# Altium project CC2745R10_ChannelSounding_HW.PrjPcb
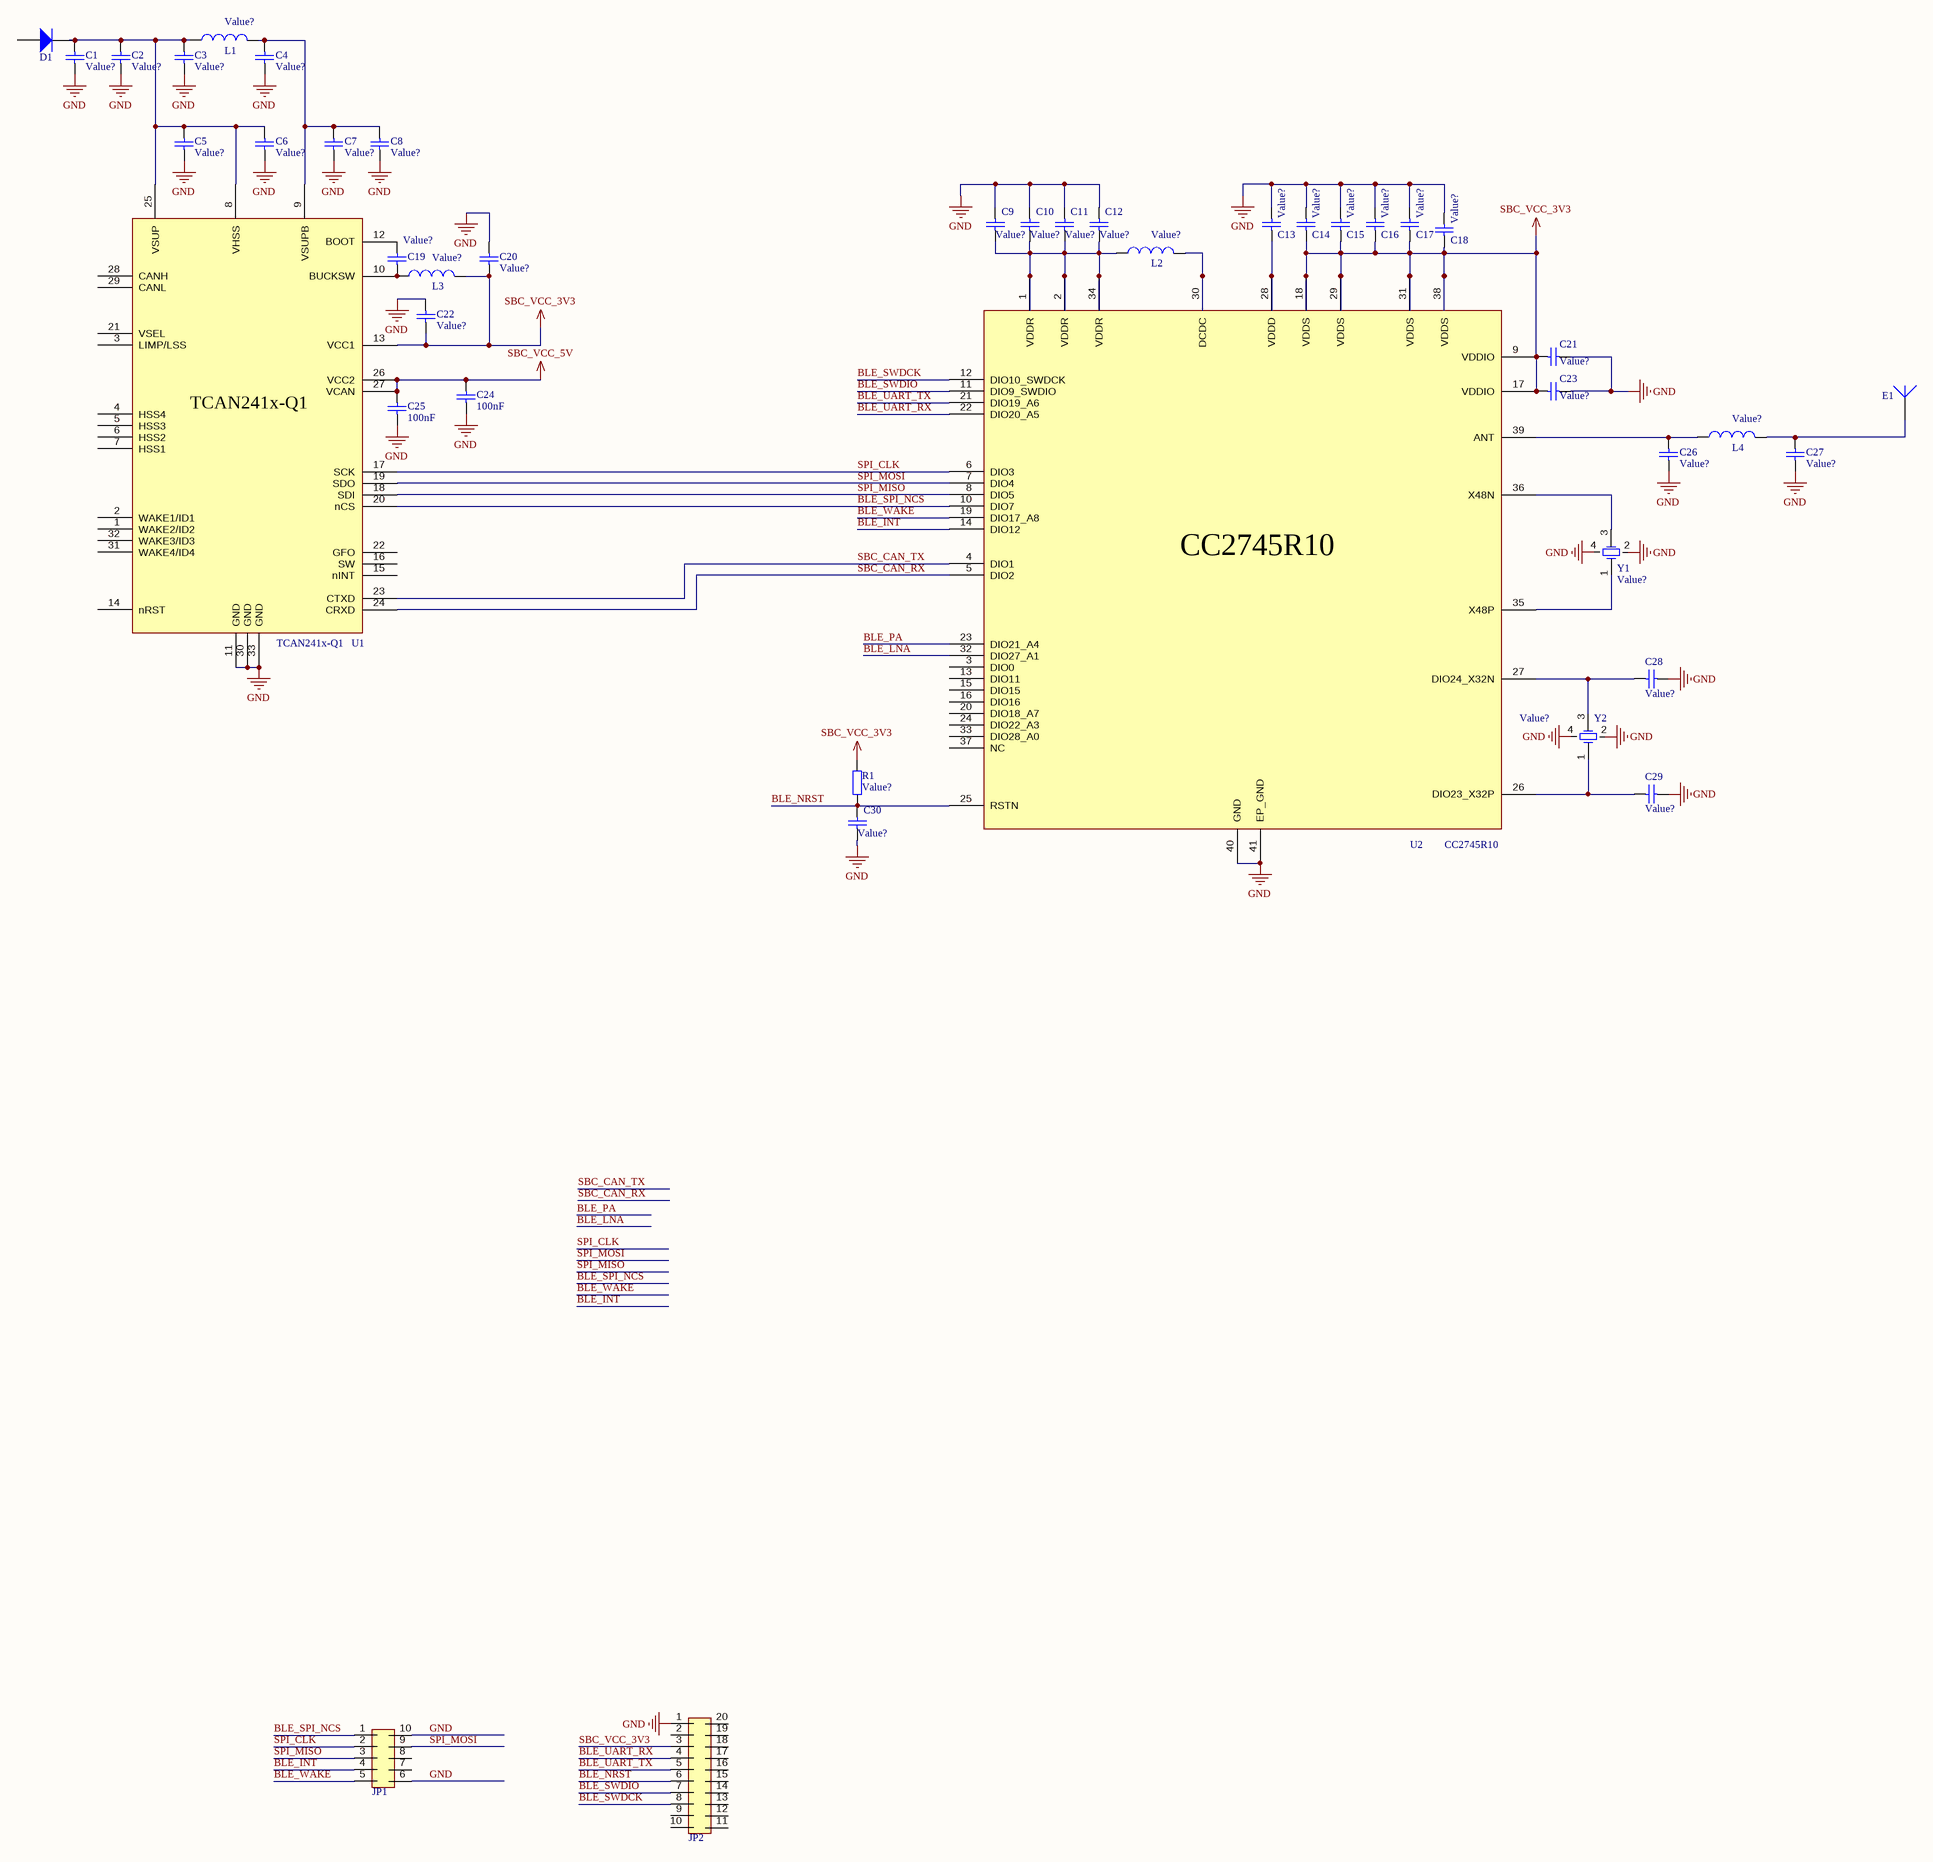
[diagram p0: Schematic.SchDoc]
1 sheet, 43 parts. Net scope: global (net labels, ports and power ports of the same name join across sheets).
Board file: Layout.PcbDoc

## Sheet Schematic.SchDoc
size 594 x 420 mm; SheetNumber: 1; SheetTotal: 1

### Parts
C1  value Value?  (hidden comment: Cap)
C2  value Value?  (hidden comment: Cap)
C3  value Value?  (hidden comment: Cap)
C4  value Value?  (hidden comment: Cap)
C5  value Value?  (hidden comment: Cap)
C6  value Value?  (hidden comment: Cap)
C7  value Value?  (hidden comment: Cap)
C8  value Value?  (hidden comment: Cap)
C9  value Value?  (hidden comment: Cap)
C10  value Value?  (hidden comment: Cap)
C11  value Value?  (hidden comment: Cap)
C12  value Value?  (hidden comment: Cap)
C13  value Value?  (hidden comment: Cap)
C14  value Value?  (hidden comment: Cap)
C15  value Value?  (hidden comment: Cap)
C16  value Value?  (hidden comment: Cap)
C17  value Value?  (hidden comment: Cap)
C18  value Value?  (hidden comment: Cap)
C19  value Value?  (hidden comment: Cap)
C20  value Value?  (hidden comment: Cap)
C21  value Value?  (hidden comment: Cap)
C22  value Value?  (hidden comment: Cap)
C23  value Value?  (hidden comment: Cap)
C24  value 100nF  (hidden comment: Cap)
C25  value 100nF  (hidden comment: Cap)
C26  value Value?  (hidden comment: Cap)
C27  value Value?  (hidden comment: Cap)
C28  value Value?  (hidden comment: Cap)
C29  value Value?  (hidden comment: Cap)
C30  value Value?  (hidden comment: Cap)
D1  Diode  (value not drawn)
E1  Antenna  (value not drawn)
JP1  Conn_02x05_Counter_Clockwise  (value not drawn)
JP2  Conn_02x10_Counter_Clockwise  (value not drawn)
L1  value Value?  (hidden comment: Inductor)
L2  value Value?  (hidden comment: Inductor)
L3  value Value?  (hidden comment: Inductor)
L4  value Value?  (hidden comment: Inductor)
R1  value Value?  (hidden comment: Res)
U1  TCAN241x-Q1
U2  CC2745R10
Y1  value Value?  (hidden comment: Crystal)
Y2  value Value?  (hidden comment: Crystal)

### Nets
GND: C1.1 C2.1 C3.1 C4.1 C5.1 C6.1 C7.1 C8.1 C9.2 C10.2 C11.2 C12.2 C13.2 C14.2 C15.2 C16.2 C17.2 C18.2 C20.1 C21.2 C22.2 C23.2 C24.1 C25.1 C26.1 C27.1 C28.2 C29.2 C30.1 JP1.6 JP1.10 JP2.1 U1.11(GND) U1.30(GND) U1.33(GND) U2.40(GND) U2.41(EP_GND) Y1.2(GND) Y1.4(GND) Y2.2(GND) Y2.4(GND)
SBC_VCC_3V3: C14.1 C15.1 C16.1 C17.1 C18.1 C20.2 C21.1 C22.1 C23.1 JP2.3 L3.2 R1.2 U1.13(VCC1) U2.9(VDDIO) U2.17(VDDIO) U2.18(VDDS) U2.29(VDDS) U2.31(VDDS) U2.38(VDDS)
SBC_VCC_5V: C24.2 C25.2 U1.26(VCC2) U1.27(VCAN)
BLE_INT: JP1.4 U2.14(DIO12)
BLE_LNA: U2.32(DIO27_A1)
BLE_NRST: C30.2 JP2.6 R1.1 U2.25(RSTN)
BLE_PA: U2.23(DIO21_A4)
BLE_SPI_NCS: JP1.1 U1.20(nCS) U2.10(DIO7)
BLE_SWDCK: JP2.8 U2.12(DIO10_SWDCK)
BLE_SWDIO: JP2.7 U2.11(DIO9_SWDIO)
BLE_UART_RX: JP2.4 U2.22(DIO20_A5)
BLE_UART_TX: JP2.5 U2.21(DIO19_A6)
BLE_WAKE: JP1.5 U2.19(DIO17_A8)
SBC_CAN_RX: U1.24(CRXD) U2.5(DIO2)
SBC_CAN_TX: U1.23(CTXD) U2.4(DIO1)
SPI_CLK: JP1.2 U1.17(SCK) U2.6(DIO3)
SPI_MISO: JP1.3 U1.18(SDI) U2.8(DIO5)
SPI_MOSI: JP1.9 U1.19(SDO) U2.7(DIO4)
NetC1_2: C1.2 C2.2 C3.2 C5.2 C6.2 D1.2(K) L1.1 U1.8(VHSS) U1.25(VSUP)
NetC4_2: C4.2 C7.2 C8.2 L1.2 U1.9(VSUPB)
NetC9_1: C9.1 C10.1 C11.1 C12.1 L2.1 U2.1(VDDR) U2.2(VDDR) U2.34(VDDR)
NetC13_1: C13.1 U2.28(VDDD)
NetC19_1: C19.1 L3.1 U1.10(BUCKSW)
NetC19_2: C19.2 U1.12(BOOT)
NetC26_2: C26.2 L4.1 U2.39(ANT)
NetC27_2: C27.2 E1.1(A) L4.2
NetC28_1: C28.1 U2.27(DIO24_X32N) Y2.3(OSC2)
NetC29_1: C29.1 U2.26(DIO23_X32P) Y2.1(OSC1)
NetL2_2: L2.2 U2.30(DCDC)
NetU2_35: U2.35(X48P) Y1.1(OSC1)
NetU2_36: U2.36(X48N) Y1.3(OSC2)

Not connected (* = marked no-connect by the designer): D1 1(A); JP1 7 8; JP2 2 9 10 11 12 13 14 15 16 17 18 19 20; U1 1(WAKE2/ID2) 2(WAKE1/ID1) 3(LIMP/LSS) 4(HSS4) 5(HSS3) 6(HSS2) 7(HSS1) 14(nRST) 15(nINT) 16(SW) 21(VSEL) 22(GFO) 28(CANH) 29(CANL) 31(WAKE4/ID4) 32(WAKE3/ID3); U2 3(DIO0) 13(DIO11) 15(DIO15) 16(DIO16) 20(DIO18_A7) 24(DIO22_A3) 33(DIO28_A0) 37(NC)

### Notes on the sheet
- DWG NO:
- REV:
- THIS DOCUMENT AND THE DATA DISCLOSED HEREIN OR
- HEREWITH IS THE PROPERTY OF ALTIUM LIMITED AND MAY
- BE FREELY DISTRIBUTED IN WHOLE. NO RIGHTS ARE
- RESERVED OR EXPRESS OR IMPLIED WARANTEE GIVEN.
- REVISION
- DESCRIPTION
- DATE
- APPROVED
- ENG:
- APPROVALS
- PROJECT
- DSN:
- CHK:
- REFERENCE DOCUMENTS
- PROJECT REVISION:
- TITLE
- DOCUMENT REVISION:
- DESIGN ITEM:
- BOM:
- FAB DWG:
- PCB DWG:
- ASSY DWG:
- SCALE:
- A2
- SIZE
- CAGE CODE
- FILE NAME
- DWG NO.
- SHEET
- OF
- REV

### Library data of the parts
C1-C30 = Cap: Capacitor
D1 = Diode: Value: Value?
JP1 = Conn_02x05_Counter_Clockwise: Connector 02x05 counter clockwise
JP2 = Conn_02x10_Counter_Clockwise: Connector 02x10 counter clockwise
R1 = Res: Resistor
U1 = TCAN241x-Q1: TCAN241x-Q1 Automotive CAN FD System Basis Chip SBC) with Integrated Buck Regulator and Watchdog
U2 = CC2745R10_Q1
Y1 Y2 = Crystal: Crystal 4 pins